# EasyEDA Pro project JLinkWiFi.eprj

# Schematic Schematic1
Board Name: Board1; Create Date: 2025-09-20; Page Name: P1; Project Name: JLinkWiFi; Schematic Name: Schematic1; Update Date: 2025-09-23; Company: 嘉立创EDA; Page Size: A4; Version: V1.0
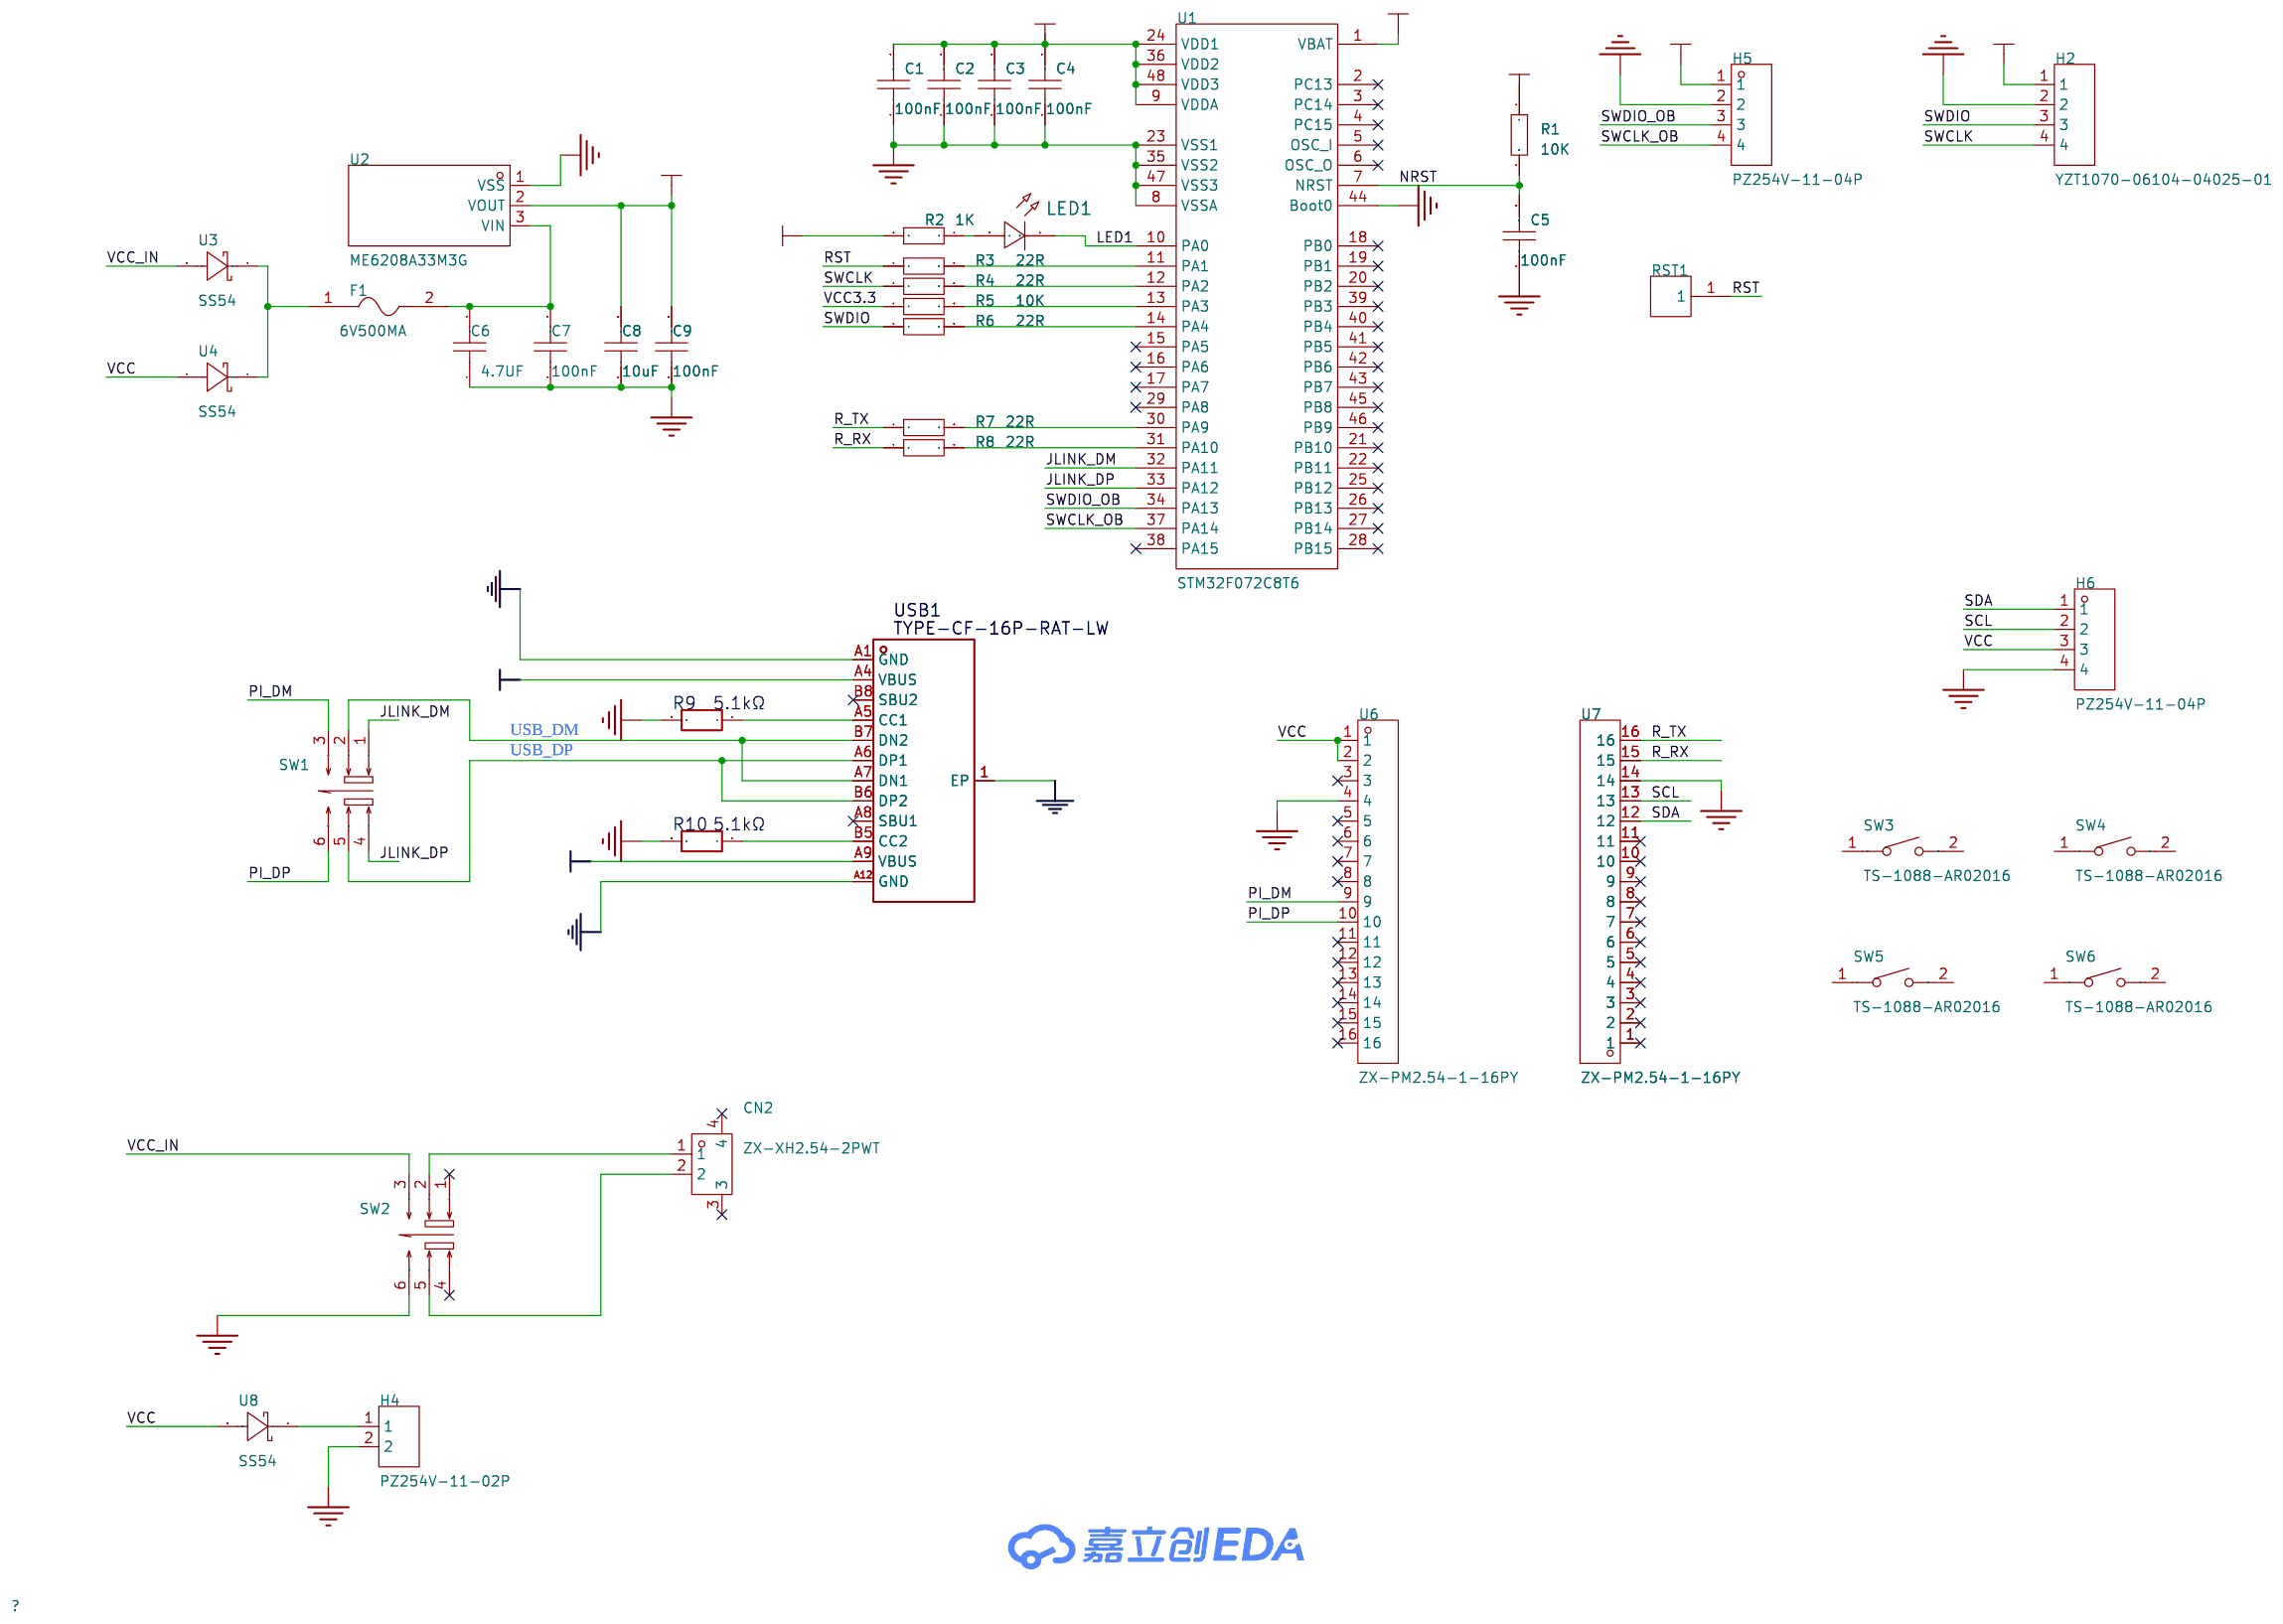
[diagram p0: schematic sheet]

## Parts
C1  100nF  [C0603]
C2  100nF  [C0603]
C3  100nF  [C0603]
C4  100nF  [C0603]
C5  100nF  [C0603]
C6  4.7UF  [C0603]
C7  100nF  [C0603]
C8  10uF  [C0603]
C9  100nF  [C0603]
CN2  ZX-XH2.54-2PWT  [CONN-SMD_2P-P2.54_MEGASTAR_ZX-XH2.54-2PWT]
F1  6V500MA  [F0805]
H2  YZT1070-06104-04025-01  [HDR-TH_4P-P2.54-H-M-W6.0]
H4  PZ254V-11-02P  [HDR-TH_2P-P2.54-V-M]
H5  PZ254V-11-04P  [HDR-TH_4P-P2.54-V-M]
H6  PZ254V-11-04P  [HDR-TH_4P-P2.54-V-M]
LED1  -  [LED_0603]
R1  10K  [R0603]
R2  1K  [R0603]
R3  22R  [R0603]
R4  22R  [R0603]
R5  10K  [R0603]
R6  22R  [R0603]
R7  22R  [R0603]
R8  22R  [R0603]
R9  5.1kΩ  [R0603]
R10  5.1kΩ  [R0603]
RST1  -  [PAD_1.5*1.5MM]
SW1  XKB5858-Z-TP-75  [SW-SMD_6P-L5.8-W5.8-P2.00-LS8.2-BL]
SW2  XKB5858-Z-TP-75  [SW-SMD_6P-L5.8-W5.8-P2.00-LS8.2-BL]
SW3  TS-1088-AR02016  [SW-SMD_L3.9-W3.0-P4.45]
SW4  TS-1088-AR02016  [SW-SMD_L3.9-W3.0-P4.45]
SW5  TS-1088-AR02016  [SW-SMD_L3.9-W3.0-P4.45]
SW6  TS-1088-AR02016  [SW-SMD_L3.9-W3.0-P4.45]
U1  STM32F072C8T6  [LQFP-48_L7.0-W7.0-P0.50-LS9.0-BL]
U2  ME6208A33M3G  [SOT-23-3_L2.9-W1.3-P1.90-LS2.4-BR]
U3  SS54  [SMB_L4.3-W3.6-LS5.4-RD]
U4  SS54  [SMB_L4.3-W3.6-LS5.4-RD]
U6  ZX-PM2.54-1-16PY  [HDR-TH_16P-P2.54-V-F-1]
U7  ZX-PM2.54-1-16PY  [HDR-TH_16P-P2.54-V-F-1]
U8  SS54  [SMB_L4.3-W3.6-LS5.4-RD]
USB1  TYPE-CF-16P-RAT-LW  [TYPE-C-SMD_TYPE-CF-16P-RAT-LW]

## Library data of the parts
C1-C9 = CAP_0603: Supplier Footprint: 0603
CN2 = ZX-XH2.54-2PWT: LCSC Part Name: 1x2P 间距:2.5mm 卧贴 系列:XH; Supplier Part: C7429671; Manufacturer: Megastar(兆星); Supplier Footprint: SMD,P=2.5mm,卧贴; JLCPCB Part Class: 扩展库; Datasheet: https://item.szlcsc.com/datasheet/ZX-XH2.54-2PWT/8427588.html; Supplier: LCSC; Pins Structure: 1x2P; Pitch: 2.5mm; Mounting Type: 卧贴; Reference Series: XH; Number of Pins: 2P; Number of Rows: 1; Number of PINs Per Row: 2; Current Rating: 3A; Contact Material: 黄铜; Contact Plating: 锡; Operating Temperature: -25℃~+85℃; Voltage Rating: 250V; Supplementary Features: 辅助焊脚; Color: 米色; Z-Height of the Board: 6.2mm; X-Length of Bottom Edge on Board (Spacing Line): 10mm; Y-Width of Bottom Edge on Board: 10.5mm
F1 = SMD0805-010-24V: 最大电压:24V;最大电流:100A;保持电流:100mA;跳闸电流:300mA;; LCSC Part Name: 24V 100mA 0805自恢复; Supplier Part: C70055; Manufacturer: 台湾陆海; Supplier Footprint: 0805; JLCPCB Part Class: Extended Part; Datasheet: https://atta.szlcsc.com/upload/public/pdf/source/20230404/065DFBBD97B50047427C65C19D90EC24.pdf; Supplier: LCSC; Operating Voltage (Max): 24V; Current Rating (Max): 100A; Hold Current: 100mA; Trip Current: 300mA
H2 = YZT1070-06104-04025-01: LCSC Part Name: 间距:2.54mm; Supplier Part: C22368234; Manufacturer: Xinyangze(鑫扬泽); Supplier Footprint: 弯插,P=2.54mm; JLCPCB Part Class: 扩展库; Datasheet: https://item.szlcsc.com/datasheet/YZT1070-06104-04025-01/23843861.html; Supplier: LCSC; Pitch: 2.54mm; Number of Pins: 4P
H4 = PZ254V-11-02P: LCSC Part Name: 1x2P 间距:2.54mm 方针 直插; Supplier Part: C492401; Manufacturer: XFCN(兴飞); Supplier Footprint: 插件,P=2.54mm; JLCPCB Part Class: 扩展库; Datasheet: https://item.szlcsc.com/datasheet/PZ254V-11-02P/502957.html; Supplier: LCSC; Pin Structure: 1x2P; Pitch: 2.54mm; Circluar Pins/Square Pins: 方针; Mounting Type: 直插; Number of Rows: 单排; Number of Pins: 2P; Length of Mating Pin: 6mm; Insulation Height: 2.5mm; Length of End Connection Pin: 3mm; Contact Material: 黄铜; Operating Temperature: -40℃~+105℃; Color: 黑色
H5 H6 = PZ254V-11-04P: LCSC Part Name: 1x4P 间距:2.54mm 方针 直插; Supplier Part: C2691448; Manufacturer: XFCN(兴飞); Supplier Footprint: 插件,P=2.54mm; JLCPCB Part Class: 扩展库; Datasheet: https://item.szlcsc.com/datasheet/PZ254V-11-04P/2801085.html; Supplier: LCSC; Pin Structure: 1x4P; Pitch: 2.54mm; Circluar Pins/Square Pins: 方针; Mounting Type: 直插; Number of Rows: 单排; Number of Pins: 4P; Current Rating: 3A; Voltage Rating (Max): 250V; Length of Mating Pin: 6mm; Insulation Height: 2.5mm; Length of End Connection Pin: 3mm; Operating Temperature: -40℃~+105℃; Color: 黑色
LED1 = LED_0603-R: Supplier Footprint: 0603
R1-R8 = Res_0603: Supplier Footprint: 0603
R9 R10 = 10kΩ: Supplier: LCSC; Supplier Part: C20138101; Manufacturer: VISHAY(威世); Manufacturer Part: MCT0603MG1002BP500; JLCPCB Part Class: Extended Part
RST1 = 测试点1.5x1.5mm
SW1 SW2 = XKB5858-Z-TP-75: LCSC Part Name: 按键开关5.8*按键开关5.8贴片自锁开关 平头; Supplier Part: C692487; Manufacturer: XKB Connection(中国星坤); Supplier Footprint: SMD; JLCPCB Part Class: 扩展库; Datasheet: https://item.szlcsc.com/datasheet/XKB5858-Z-TP-75/724370.html; Supplier: LCSC; Self Lock / No Lock: 自锁; Actuator Style: 方形按钮; Mounting Type: 立贴; Contact Current: 100mA; Voltage Rating: 30V; Actuator/Cap Color: 白色; With Lamp: 不带; Termination Style: SMD接片; Operating Force: 1.6N; Operating Temperature: -15℃~+55℃; Life: 10万次
SW3-SW6 = TS-1088-AR02016: 电路结构:单刀单掷;按钮形状:圆形按钮;作用力:160gf;安装方式:立贴;开关长度:4mm;开关宽度:3mm;开关高度:2mm;带支架:不带;触点电流:50mA;额定电压(DC):12V;绝缘电阻:100MΩ;机械寿命:10万次;; LCSC Part Name: 4*3*2mm 立贴 轻触开关; Supplier Part: C720477; Manufacturer: XUNPU(讯普); Supplier Footprint: SMD; JLCPCB Part Class: 扩展库; Datasheet: https://atta.szlcsc.com/upload/public/pdf/source/20200810/C720475_60D09DD6C54279ADDB2DC25100F1CC11.pdf; Supplier: LCSC; Circuit: 单刀单掷; Actuator Style: 圆形按钮; Operating Force: 160gf; Mounting Style: 立贴; Switch Length: 4mm; Switch Width: 3mm; Switch Height: 2mm; Strike Gundam: 不带; Contact Current: 50mA; Voltage Rating (DC): 12V; Insulation Resistance: 100MΩ; Actuator/Cap Color: 黑色; Pin Style: SMD接片; Mechanical Life: 10万次; Operating Temperature: -30℃~+80℃
U1 = STM32F072C8T6: Supplier Part: C80488; Manufacturer: ST(意法半导体); Supplier Footprint: LQFP-48(7x7); JLCPCB Part Class: Extended Part; Datasheet: https://atta.szlcsc.com/upload/public/pdf/source/20160816/1471343013459.pdf; Supplier: LCSC
U2 = ME6208A33M3G: 输出类型:固定;输出极性:正;最大输入电压:18V;输出电压:3.3V;输出电流:200mA;电源纹波抑制比(PSRR):-;; LCSC Part Name: 输入18V 输出3.3V 200mA; Supplier Part: C235314; Manufacturer: MICRONE(南京微盟); Supplier Footprint: SOT-23; JLCPCB Part Class: Extended Part; Datasheet: https://atta.szlcsc.com/upload/public/pdf/source/20180719/C235314_F2180C808F252B997125710FED69CC70.pdf; Supplier: LCSC; Output Type: 固定; Output Polarity: 正; Number of Outputs: 1; Maximum Input Voltage: 18V; Output Voltage: 3.3V; Dropout Voltage: 1V@(200mA); Output Current: 200mA
U3 U4 U8 = SS54_C5200096: LCSC Part Name: IF:5A VR:40V VF:0.55V IFSM:150A; Supplier Part: C5200096; Manufacturer: HXY MOSFET(华轩阳电子); Supplier Footprint: SMB; JLCPCB Part Class: 扩展库; Datasheet: https://item.szlcsc.com/datasheet/SS54/5888311.html; Supplier: LCSC; Diode Configuration: 独立式; Voltage - Forward(Vf@If): 550mV@5A; Voltage - DC Reverse(Vr): 40V; Current - Rectified: 5A; Reverse Leakage Current (Ir): 500uA; Operating Junction Temperature Range: -55℃~+125℃; Non-Repetitive Peak Forward Surge Current: 150A
U6 U7 = ZX-PM2.54-1-16PY: LCSC Part Name: 1x16P 间距:2.54mm 直插; Supplier Part: C7499334; Manufacturer: Megastar(兆星); Supplier Footprint: 插件,P=2.54mm; JLCPCB Part Class: 扩展库; Datasheet: https://item.szlcsc.com/datasheet/ZX-PM2.54-1-16PY/8573995.html; Supplier: LCSC; Holes Structure: 1x16P; Pitch: 2.54mm; Circular Hole / Square Hole: 方孔; Mounting Type: 直插; Number of Rows: 单排; Number of Positions: 16P; Current Rating: 3A; Holes Direction: 顶部; Insulation Height: 8.5mm; Contact Plating: 金; Operating Temperature: -40℃~+105℃; PIN Length: 3.2mm
USB1 = TYPE-CF-16P-RAT-LW: Supplier: LCSC; Supplier Part: C9900026770; Manufacturer: null; JLCPCB Part Class: Extended Part

## Nets
GND: C1.1 C2.1 C3.1 C4.1 C5.1 C6.1 C7.1 C8.1 C9.1 H2.2 H4.2 H5.2 H6.4 R9.2 R10.2 SW2.6 U1.8(VSSA) U1.23(VSS1) U1.35(VSS2) U1.44(Boot0) U1.47(VSS3) U2.1(VSS) U6.4 U7.14 USB1.1(EP) USB1.A1(GND) USB1.A12(GND)
VCC: H6.3 U4.2 U6.1 U6.2 U8.2 USB1.A4(VBUS) USB1.A9(VBUS)
VCC3.3: C1.2 C2.2 C3.2 C4.2 C8.2 C9.2 H2.1 H5.1 R1.1 R2.2 R5.1 U1.1(VBAT) U1.9(VDDA) U1.24(VDD1) U1.36(VDD2) U1.48(VDD3) U2.2(VOUT)
VCC_IN: SW2.3 U3.2
JLINK_DM: SW1.1 U1.32(PA11)
JLINK_DP: SW1.4 U1.33(PA12)
LED1: LED1.1(C) U1.10(PA0)
NRST: C5.2 R1.2 U1.7(NRST)
PI_DM: SW1.3 U6.9
PI_DP: SW1.6 U6.10
R_RX: R8.1 U7.15
R_TX: R7.1 U7.16
RST: R3.1 RST1.1
SCL: H6.2 U7.13
SDA: H6.1 U7.12
SWCLK: H2.4 R4.1
SWCLK_OB: H5.4 U1.37(PA14)
SWDIO: H2.3 R6.1
SWDIO_OB: H5.3 U1.34(PA13)
USB_DM: SW1.2 USB1.A7(DN1) USB1.B7(DN2)
USB_DP: SW1.5 USB1.A6(DP1) USB1.B6(DP2)
$1N1088: C6.2 C7.2 F1.2 U2.3(VIN)
$1N1113: R8.2 U1.31(PA10)
$1N1114: R7.2 U1.30(PA9)
$1N1117: LED1.2(A) R2.1
$1N1129: R3.2 U1.11(PA1)
$1N1130: R4.2 U1.12(PA2)
$1N1131: R5.2 U1.13(PA3)
$1N1132: R6.2 U1.14(PA4)
$1N1848: R9.1 USB1.A5(CC1)
$1N1849: R10.1 USB1.B5(CC2)
$1N2247: CN2.2 SW2.5
$1N2365: H4.1 U8.1
$1N3943: CN2.1 SW2.2
$1N4576: F1.1 U3.1 U4.1

Not connected (* = marked no-connect by the designer): CN2 3* 4*; SW2 1* 4*; SW3 1 2; SW4 1 2; SW5 1 2; SW6 1 2; U1 2(PC13)* 3(PC14)* 4(PC15)* 5(OSC_I)* 6(OSC_O)* 15(PA5)* 16(PA6)* 17(PA7)* 18(PB0)* 19(PB1)* 20(PB2)* 21(PB10)* 22(PB11)* 25(PB12)* 26(PB13)* 27(PB14)* 28(PB15)* 29(PA8)* 38(PA15)* 39(PB3)* 40(PB4)* 41(PB5)* 42(PB6)* 43(PB7)* 45(PB8)* 46(PB9)*; U6 3* 5* 6* 7* 8* 11* 12* 13* 14* 15* 16*; U7 1* 2* 3* 4* 5* 6* 7* 8* 9* 10* 11*; USB1 A8(SBU1)* B8(SBU2)*

# Board PCB1
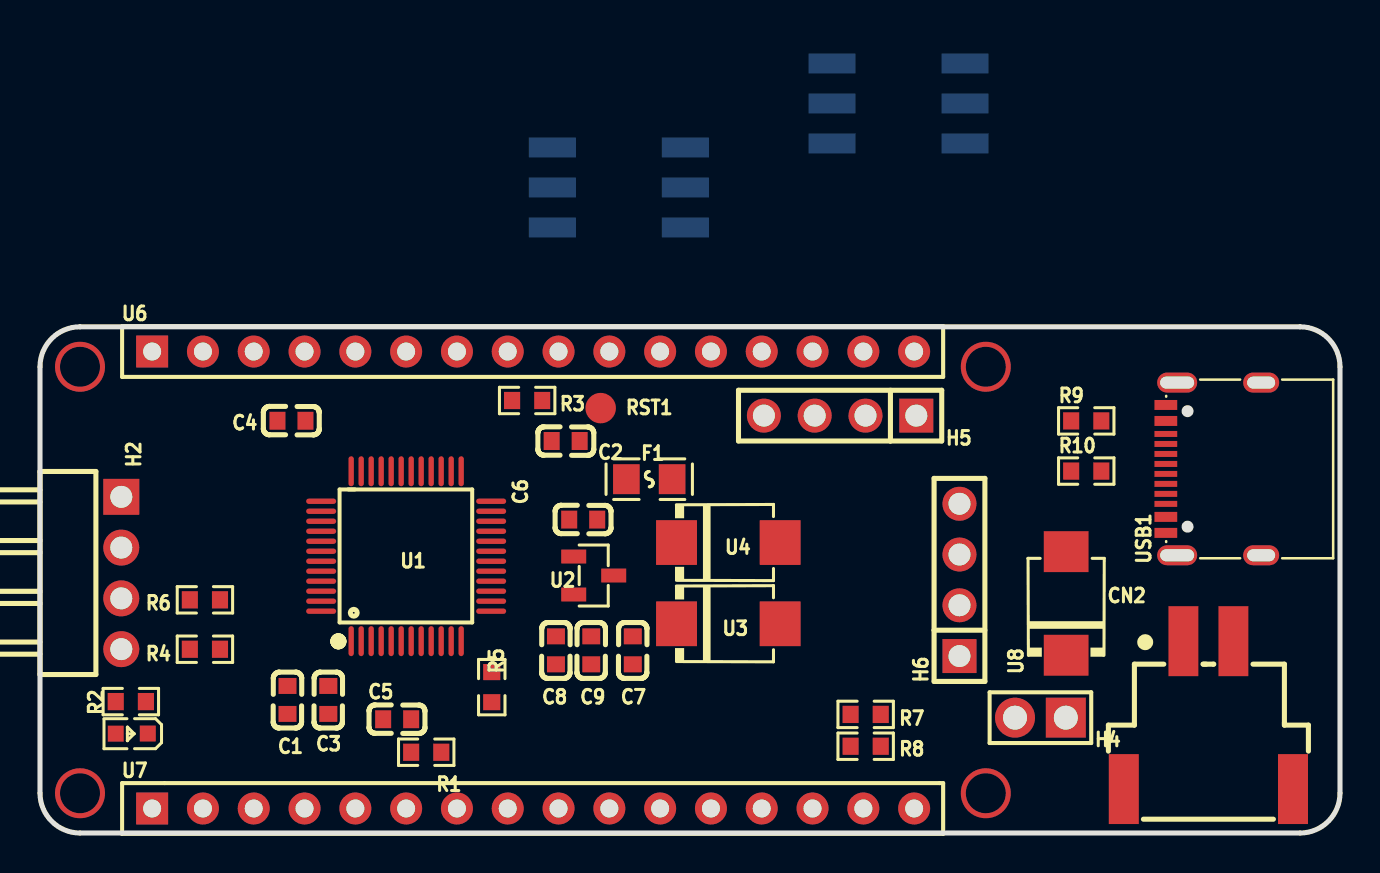
[diagram p1: board, top side]
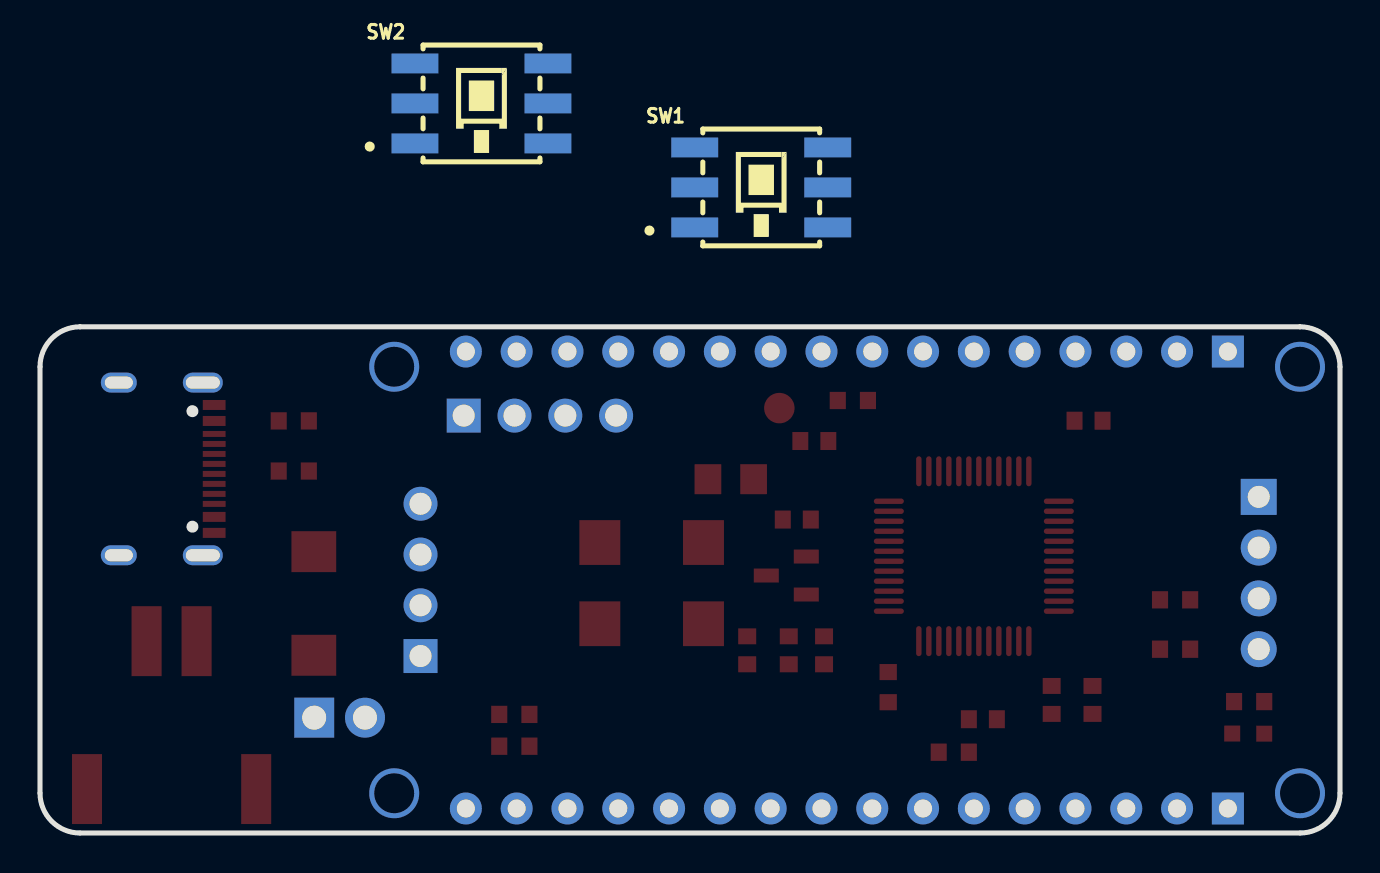
[diagram p2: board, bottom side, seen from below]

Outline 65 x 25.33 mm; copper layers: Top Layer, Bottom Layer. Coordinates in mm from the lower left corner of the outline.
Outline path: 0,23.33 0,2 arc(0.59,0.59) 2,0 63,0 arc(64.41,0.59) 65,2 65,23.33 arc(64.41,24.74) 63,25.33 2,25.33 arc(0.59,24.74) 0,23.33
Stack: Top Layer 0.035mm / Dielectric1 1.51mm FR4 er 4.5 / Bottom Layer 0.035mm

## Design rules (mm)
template: JLCPCB Capability(Two Layers Board)
spacing copperThickness1oz (default): track to track 0.102, other pairs 0.152 to 0.3
spacing copperThickness2oz: track to track 0.203, other pairs 0.152 to 0.3
track width copperThickness1oz (default): min 0.127, default 0.254, max 2.54
track width copperThickness2oz: min 0.203, default 0.254, max 2.54
differential pair differentialPair (default): width min 0.127, default 0.254, max 2.54; gap min 0.152, default 0.152
via viaSize (default): diameter min 0.5, default 0.61, max 10; hole min 0.3, default 0.305, max 6.3

## Placement (name value [footprint] x y rotation side)
C1  100nF  [C0603]  12.38 6.66 90 top
C2  100nF  [C0603]  26.28 19.61 180 top
C3  100nF  [C0603]  14.42 6.66 90 top
C4  100nF  [C0603]  12.57 20.63 0 top
C5  100nF  [C0603]  17.86 5.69 0 top
C6  4.7UF  [C0603]  27.16 15.68 0 top
C7  100nF  [C0603]  29.64 9.14 90 top
C8  10uF  [C0603]  25.8 9.14 90 top
C9  100nF  [C0603]  27.56 9.14 90 top
CN2  ZX-XH2.54-2PWT  [CONN-SMD_2P-P2.54_MEGASTAR_ZX-XH2.54-2PWT]  58.42 5.9 0 top
F1  6V500MA  [F0805]  30.46 17.7 180 top
H2  YZT1070-06104-04025-01  [HDR-TH_4P-P2.54-H-M-W6.0]  4.06 13.01 270 top
H4  PZ254V-11-02P  [HDR-TH_2P-P2.54-V-M]  50.02 5.77 180 top
H5  PZ254V-11-04P  [HDR-TH_4P-P2.54-V-M]  40 20.89 180 top
H6  PZ254V-11-04P  [HDR-TH_4P-P2.54-V-M]  45.97 12.66 90 top
LED1  -  [LED_0603]  4.54 4.97 180 top
R1  10K  [R0603]  19.31 4.04 180 top
R2  1K  [R0603]  4.54 6.58 180 top
R3  22R  [R0603]  24.36 21.64 180 top
R4  22R  [R0603]  8.25 9.2 0 top
R5  10K  [R0603]  22.59 7.3 90 top
R6  22R  [R0603]  8.25 11.67 0 top
R7  22R  [R0603]  41.28 5.94 180 top
R8  22R  [R0603]  41.28 4.34 180 top
R9  5.1kΩ  [R0603]  52.31 20.62 0 top
R10  5.1kΩ  [R0603]  52.31 18.11 0 top
RST1  -  [PAD_1.5*1.5MM]  28.16 21.64 0 top
SW1  XKB5858-Z-TP-75  [SW-SMD_6P-L5.8-W5.8-P2.00-LS8.2-BL]  28.94 32.3 180 bottom
SW2  XKB5858-Z-TP-75  [SW-SMD_6P-L5.8-W5.8-P2.00-LS8.2-BL]  42.93 36.51 180 bottom
U1  STM32F072C8T6  [LQFP-48_L7.0-W7.0-P0.50-LS9.0-BL]  18.31 13.85 0 top
U2  ME6208A33M3G  [SOT-23-3_L2.9-W1.3-P1.90-LS2.4-BR]  27.69 12.88 180 top
U3  SS54  [SMB_L4.3-W3.6-LS5.4-RD]  34.42 10.47 0 top
U4  SS54  [SMB_L4.3-W3.6-LS5.4-RD]  34.42 14.53 0 top
U6  ZX-PM2.54-1-16PY  [HDR-TH_16P-P2.54-V-F-1]  24.66 24.09 0 top
U7  ZX-PM2.54-1-16PY  [HDR-TH_16P-P2.54-V-F-1]  24.66 1.23 0 top
U8  SS54  [SMB_L4.3-W3.6-LS5.4-RD]  51.31 11.49 90 top
USB1  TYPE-CF-16P-RAT-LW  [TYPE-C-SMD_TYPE-CF-16P-RAT-LW]  58.67 18.22 90 top

## Footprints (pads in the part's own frame, mm; a bottom-side part is the same pattern mirrored in y, then rotated)
C0603
  rect 0.8x0.9 smd: 1(-0.7,0) 2(0.7,0)
CONN-SMD_2P-P2.54_MEGASTAR_ZX-XH2.54-2PWT
  rect 1.5x3.5 smd: 1(-1.25,3.7) 2(1.25,3.7) 3(-4.23,-3.7) 4(4.23,-3.7)
F0805
  rect 1.335x1.5 smd: 1(-1.143,0) 2(1.143,0)
HDR-TH_2P-P2.54-V-M
  rect 2x2 hole 1.2: 1(-1.27,0)
  round 2 hole 1.2: 2(1.27,0)
HDR-TH_4P-P2.54-H-M-W6.0
  rect 1.8x1.8 hole 1.1: 1(-3.81,0)
  round 1.8 hole 1.1: 2(-1.27,0) 3(1.27,0) 4(3.81,0)
HDR-TH_4P-P2.54-V-M
  rect 1.7x1.7 hole 1.1: 1(-3.81,0)
  round 1.7 hole 1.1: 2(-1.27,0) 3(1.27,0) 4(3.81,0)
HDR-TH_16P-P2.54-V-F-1
  rect 1.6x1.6 hole 0.9: 1(-19.05,0)
  round 1.6 hole 0.9: 2(-16.51,0) 3(-13.97,0) 4(-11.43,0) 5(-8.89,0) 6(-6.35,0) 7(-3.81,0) 8(-1.27,0) 9(1.27,0) 10(3.81,0) 11(6.35,0) 12(8.89,0) 13(11.43,0) 14(13.97,0) 15(16.51,0) 16(19.05,0)
LED_0603
  rect 0.8x0.8 smd: 1(-0.851,-0.01) 2(0.75,-0.005)
LQFP-48_L7.0-W7.0-P0.50-LS9.0-BL
  oval 0.27x1.5 smd: 1(-2.75,-4.25) 2(-2.25,-4.25) 3(-1.75,-4.25) 4(-1.25,-4.25) 5(-0.75,-4.25) 6(-0.25,-4.25) 7(0.25,-4.25) 8(0.75,-4.25) 9(1.25,-4.25) 10(1.75,-4.25) 11(2.25,-4.25) 12(2.75,-4.25) 25(2.75,4.25) 26(2.25,4.25) 27(1.75,4.25) 28(1.25,4.25) 29(0.75,4.25) 30(0.25,4.25) 31(-0.25,4.25) 32(-0.75,4.25) 33(-1.25,4.25) 34(-1.75,4.25) 35(-2.25,4.25) 36(-2.75,4.25)
  oval 1.5x0.27 smd: 13(4.25,-2.75) 14(4.25,-2.25) 15(4.25,-1.75) 16(4.25,-1.25) 17(4.25,-0.75) 18(4.25,-0.25) 19(4.25,0.25) 20(4.25,0.75) 21(4.25,1.25) 22(4.25,1.75) 23(4.25,2.25) 24(4.25,2.75) 37(-4.25,2.75) 38(-4.25,2.25) 39(-4.25,1.75) 40(-4.25,1.25) 41(-4.25,0.75) 42(-4.25,0.25) 43(-4.25,-0.25) 44(-4.25,-0.75) 45(-4.25,-1.25) 46(-4.25,-1.75) 47(-4.25,-2.25) 48(-4.25,-2.75)
PAD_1.5*1.5MM
  round 1.524 smd: 1(-0.127,-0.381)
R0603
  rect 0.806x0.864 smd: 1(-0.753,0) 2(0.753,0)
SMB_L4.3-W3.6-LS5.4-RD
  rect 2.047x2.241 smd: 1(-2.591,0) 2(2.591,0)
SOT-23-3_L2.9-W1.3-P1.90-LS2.4-BR
  rect 1.25x0.7 smd: 1(1,-0.95) 2(1,0.95) 3(-1,0)
SW-SMD_6P-L5.8-W5.8-P2.00-LS8.2-BL
  rect 2.35x1 smd: 1(-3.325,-2) 2(-3.325,0) 3(-3.325,2) 4(3.325,-2) 5(3.325,0) 6(3.325,2)
TYPE-C-SMD_TYPE-CF-16P-RAT-LW
  oval 1x2 hole 0.6x1.7: 1(-4.32,1.816) 1(4.32,1.816)
  oval 1x1.8 hole 0.6x1.4: 1(-4.32,-2.384) 1(4.32,-2.384)
  rect 0.5x1.14 smd: A1(-3.2,2.384) A4(-2.4,2.384) A9(2.4,2.384) A12(3.2,2.384)
  rect 0.3x1.14 smd: A5(-1.25,2.384) A6(-0.25,2.384) A7(0.25,2.384) A8(1.25,2.384) B5(1.75,2.384) B6(0.75,2.384) B7(-0.75,2.384) B8(-1.75,2.384)

## Nets
As in the schematic.

Pads without a net: CN2 3 4; SW2 1 4; U1 2 3 4 5 6 15 16 17 18 19 20 21 22 25 26 27 28 29 38 39 40 41 42 43 45 46; U6 3 5 6 7 8 11 12 13 14 15 16; U7 1 2 3 4 5 6 7 8 9 10 11; USB1 A8 B8

## Via types
v1: diameter 2.5, hole 2, Top Layer to Bottom Layer, 4 vias

## Routing (per net, layer and track width the routed paths; a pad name or vN(x,y) marks a point on that pad's centre or on a via; arc(x,y) is an arc through that point)
(no net):
  vias: v1(2,23.33) v1(2,1.99) v1(47.29,23.33) v1(47.29,1.99)
